# Altium schematic sheet BulbCommander2.SchDoc
size A4
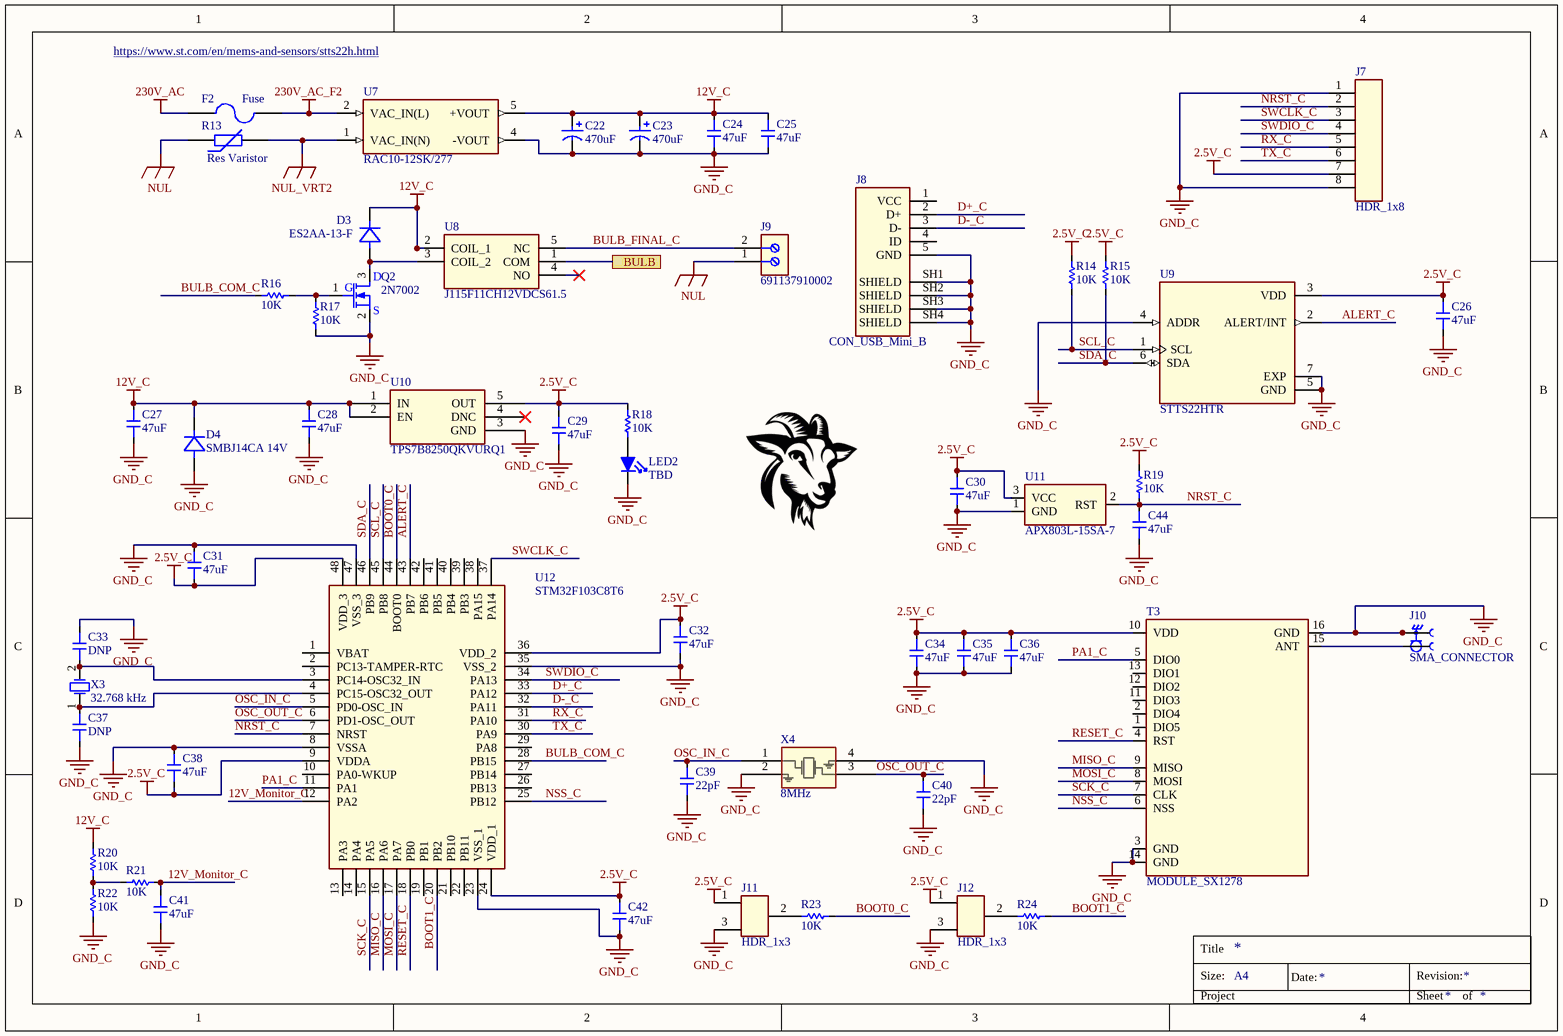
[diagram p0: BulbCommander2.SchDoc]

## Parts
C22  value 470uF  [WCAP-ASLL_D16H17]  (hidden comment: Cap Pol1)
C23  value 470uF  [WCAP-ASLL_D16H17]  (hidden comment: Cap Pol1)
C24  47uF  [2220]
C25  47uF  [2220]
C26  47uF  [CASE0603]
C27  47uF  [1206]
C28  47uF  [1206]
C29  47uF  [1206]
C30  47uF  [CASE0603]
C31  47uF  [CASE0603]
C32  47uF  [CASE0603]
C33  DNP  [CASE0603]
C34  47uF  [CASE0603]
C35  47uF  [CASE0603]
C36  47uF  [CASE0603]
C37  DNP  [CASE0603]
C38  47uF  [CASE0603]
C39  22pF  [CASE0603]
C40  22pF  [CASE0603]
C41  47uF  [CASE0603]
C42  47uF  [CASE0603]
C44  47uF  [CASE0603]
D3  ES2AA-13-F  [SMA_DIODE]
D4  SMBJ14CA 14V  [SMBJSeries_LTF-M]
F2  Fuse  [FUSE]
J7  HDR_1x8  [Header_1x8_2.54_Male]
J8  CON_USB_Mini_B  [CUI_UJ2-MBH-4-SMT]
J9  691137910002  [691137910002]
J10  SMA_CONNECTOR  [LPRS_SMA_CONNECTOR]
J11  HDR_1x3  [Header_1x3_2.54_Male]
J12  HDR_1x3  [Header_1x3_2.54_Male]
LED2  TBD  [CASE0603]
Q2  2N7002  [SOT23-3]
R13  Res Varistor  [AXIAL-0.3]
R14  10K  [CASE0603]
R15  10K  [CASE0603]
R16  10K  [CASE0603]
R17  10K  [CASE0603]
R18  10K  [CASE0603]
R19  10K  [CASE0603]
R20  10K  [CASE0603]
R21  10K  [CASE0603]
R22  10K  [CASE0603]
R23  10K  [CASE0603]
R24  10K  [CASE0603]
T3  MODULE_SX1278  [LORA SX1278]
U7  RAC10-12SK/277  [CONV_RAC10-12SK/277]
U8  J115F11CH12VDCS61.5  [J115F11CH12VDCS615U]
U9  STTS22HTR  [Sensor_6-UDFN]
U10  TPS7B8250QKVURQ1  [SOT_QKVURQ1_TEX]
U11  APX803L-15SA-7  [SOT23-3]
U12  STM32F103C8T6  [QFP50P900X900X160-48N]
X3  32.768 kHz  [XTAL_ECS-.327-12.5-34B-C-TR]
X4  8MHz  [XTAL4P_ABM3B_ABR]

## Ports
BULB

## Nets
2.5V_C: C26.2 C29.2 C30.2 C31.1 C32.2 C34.2 C35.2 C36.2 C38.2 C42.2 J7.7 J11.1 J12.1 R14.2 R15.2 R18.2 R19.2 T3.10(VDD) U9.3(VDD) U10.5(OUT) U11.3(VCC) U12.9(VDDA) U12.24(VDD_1) U12.36(VDD_2) U12.48(VDD_3)
12V_C: C22.1 C23.1 C24.2 C25.2 C27.2 C28.2 D3.1 D4.1 R20.2 U7.5(+VOUT) U8.2(COIL_1) U10.1(IN) U10.2(EN)
230V_AC: F2.1
230V_AC_F2: F2.2 U7.2(VAC_IN(L))
GND_C: C22.2 C23.2 C24.1 C25.1 C26.1 C27.1 C28.1 C29.1 C30.1 C31.2 C32.1 C33.2 C34.1 C35.1 C36.1 C37.2 C38.1 C39.2 C40.2 C41.2 C42.1 C44.1 D4.2 J7.1 J7.8 J8.5(GND) J8.SH1(SHIELD) J8.SH2(SHIELD) J8.SH3(SHIELD) J8.SH4(SHIELD) J10.G1 J10.G2 J10.G3 J10.G4 J11.3 J12.3 LED2.2(K) Q2.2(S) R17.1 R22.1 T3.3(GND) T3.14(GND) T3.16(GND) U7.4(-VOUT) U9.4(ADDR) U9.5(GND) U9.7(EXP) U10.3(GND) U11.1(GND) U12.8(VSSA) U12.23(VSS_1) U12.35(VSS_2) U12.47(VSS_3) X4.2 X4.4
NUL: J9.1 R13.1
NUL_VRT2: R13.2 U7.1(VAC_IN(N))
12V_Monitor_C: C41.1 R21.2 U12.12(PA2)
ALERT_C: U9.2(ALERT/INT) U12.43(PB7)
BOOT0_C: R23.1 U12.44(BOOT0)
BOOT1_C: R24.1 U12.20(PB2)
BULB: U8.1(COM) ; port BULB
BULB_COM_C: R16.2 U12.28(PB15)
BULB_FINAL_C: J9.2 U8.5(NC)
D+_C: J8.2(D+) U12.33(PA12)
D-_C: J8.3(D-) U12.32(PA11)
MISO_C: T3.9(MISO) U12.16(PA6)
MOSI_C: T3.8(MOSI) U12.17(PA7)
NRST_C: C44.2 J7.2 R19.1 U11.2(RST) U12.7(NRST)
NSS_C: T3.6(NSS) U12.25(PB12)
OSC_IN_C: C39.1 U12.5(PD0-OSC_IN) X4.1
OSC_OUT_C: C40.1 U12.6(PD1-OSC_OUT) X4.3
PA1_C: T3.5(DIO0) U12.11(PA1)
RESET_C: T3.4(RST) U12.18(PB0)
RX_C: J7.5 U12.31(PA10)
SCK_C: T3.7(CLK) U12.15(PA5)
SCL_C: R14.1 U9.1(SCL) U12.45(PB8)
SDA_C: R15.1 U9.6(SDA) U12.46(PB9)
SWCLK_C: J7.3 U12.37(PA14)
SWDIO_C: J7.4 U12.34(PA13)
TX_C: J7.6 U12.30(PA9)
NetC33_1: C33.1 U12.3(PC14-OSC32_IN) X3.2(OSC2)
NetC37_1: C37.1 U12.4(PC15-OSC32_OUT) X3.1(OSC1)
NetD3_2: D3.2 Q2.3(D) U8.3(COIL_2)
NetJ10_1: J10.1 T3.15(ANT)
NetJ11_2: J11.2 R23.2
NetJ12_2: J12.2 R24.2
NetLED2_1: LED2.1(A) R18.1
NetQ2_1: Q2.1(G) R16.1 R17.2
NetR20_1: R20.1 R21.1 R22.2

Not connected (* = marked no-connect by the designer): J8 1(VCC) 4(ID); T3 1(DIO5) 2(DIO4) 11(DIO3) 12(DIO2) 13(DIO1); U8 4(NO)*; U10 4(DNC)*; U12 1(VBAT) 2(PC13-TAMPER-RTC) 10(PA0-WKUP) 13(PA3) 14(PA4) 19(PB1) 21(PB10) 22(PB11) 26(PB13) 27(PB14) 29(PA8) 38(PA15) 39(PB3) 40(PB4) 41(PB5) 42(PB6)

## Notes on the sheet
- https://www.st.com/en/mems-and-sensors/stts22h.html
- Title
- Size:
- A4
- Date:
- Revision:
- Project
- Sheet
- of

## Library data of the parts
C22 C23 = Capacitor_Pol_470uF: Published: 8-Jun-2000; LatestRevisionDate: 17-Jul-2002; LatestRevisionNote: Re-released for DXP Platform.; PackageReference: RB7.6-15; Publisher: Altium Limited; PackageDescription: Polarized Capacitor (Radial); 2 Leads
C24 C25 = Capacitor_47uF_2220: CAP CER 47uF 20% 35V X7R 2220; MFR: TBD; MFR PN: TBD; Supplier: TBD; Supplier PN: TBD; Datasheet: TBD
C26-C32 C34-C36 C38-C42 C44 = Capacitor_47uF_1206: CAP CER 47uF 20% 35V X7R 2220; MFR: TBD; MFR PN: TBD; Supplier: TBD; Supplier PN: TBD; Datasheet: TBD
C33 C37 = Capacitor_47uF_0603: CAP CER 47uF 20% 35V X7R 2220; MFR: TBD; MFR PN: TBD; Supplier: TBD; Supplier PN: TBD; Datasheet: TBD
D3 = Diode_SMA: DIODE STANDARD 50V 2A SMA; MFR: Diodes Incoprated; MFR PN: ES2AA-13-F; SUpplier: DigiKey; Supplier PN: ES2AA-FDICT-ND; Datasheet: https://www.digikey.ro/en/products/detail/diodes-incorporated/ES2AA-13-F/765452?curr=usd&utm_campaign=buynow&utm_medium=aggregator&utm_source=octopart
D4 = Diode_SMBJ14CA: SMBJ14CA TVS DIODE 14V; Mfr_Name: Littelfuse Inc
J7 = HDR_1x8: HDR MALE 2.54MM PCB; MFR: Wurth; MFR PN: 691210910002; Datasheet: https://www.digikey.ro/en/products/detail/w%C3%BCrth-elektronik/691210910002/10668428?s=N4IgTCBcDaIGwE4CMYkAZlqxAugXyA; Supplier PN: 732-691210910002-ND; Supplier: Digi Key
J8 = CON_USB_Mini_B: USB B mini; MFR: Same Sky; MFR PN: 102-5892-1-ND; Datasheet: https://www.digikey.ro/en/products/detail/same-sky-formerly-cui-devices/UJ2-MBH-4-SMT-TR/6188086; Supplier: DigiKey; Supplier PN: 102-5892-1-ND
J9 = CON_1x2: TERM BLOCK 2P HORIZON 7.5MM PCB; MFR: Wurth; MFR PN: 691101710002; Datasheet: https://www.digikey.ro/en/products/detail/w%C3%BCrth-elektronik/691101710002/2060522?s=N4IgTCBcDaIGwE4CMSAMSDsbWogXQF8g; Supplier PN: 732-2026-ND; Supplier: Digi Key
J10 = SMA_CONNECTOR: Straight SMA Connector; MP: altium_native_batch; Value: *; Package: None; Availability: Unavailable; Price: None
J11 J12 = HDR_1x3: HDR MALE 3 x 2.54MM PCB; MFR: Wurth; MFR PN: 691210910002; Datasheet: https://www.digikey.ro/en/products/detail/w%C3%BCrth-elektronik/691210910002/10668428?s=N4IgTCBcDaIGwE4CMYkAZlqxAugXyA; Supplier PN: 732-691210910002-ND; Supplier: Digi Key
LED2 = LED: Typical INFRARED GaAs LED
Q2 = Transistor_NMOS: MOSFET N-CH 60V 280MA SOT23-3; MFR: Microchip; MFR PN: 2N7002-G; Supplier: 689-2N7002-G; Supplier PN: 689-2N7002-G; Datasheetr: https://eu.mouser.com/ProductDetail/Microchip-Technology/2N7002-G?qs=D%2FHwGy7fPj%2F0m3YgJ%252BOEvg%3D%3D&gad_source=1&gclid=CjwKCAiA-vOsBhAAEiwAIWR0TUe7q_QostOicZHu1AHXgQXTk64doIjIByY-NhPhM9vjgvrvT5qG4BoC-HkQAvD_BwE&_gl=1*1hvi63b*_ga*MjAyNjQwOTA4MS4xNzA0NjI4Mjkx*_ga_15W4STQT4T*MTcwNDgyMjg3Ni4yLjEuMTcwNDgyMjg3Ni42MC4wLjA.
R13 = Res Varistor: Varistor (Voltage-Sensitive Resistor); Published: 24-Mar-1999; LatestRevisionDate: 29-May-2009; LatestRevisionNote: IPC-7351 Footprint Added.; PackageVersion: Mar-2003; PackageReference: 6-0805; Publisher: Altium Limited; PackageDescription: Chip Resistor 0805 Case Size; Code_IPC: RESC2012
R14-R24 = Resistor_10K_0603: RES 10K 1% 1/10W 0603; MFR: YAGEO; MFR PN: RC0603FR-0710KL; Supplier: Mouser; Supplier PN: 603-RC0603FR-0710KL; Datasheet: https://eu.mouser.com/ProductDetail/YAGEO/RC0603FR-0710KL?qs=grNVn54RoB%252B3GtjbJj3wJQ%3D%3D
T3 = MODULE_SX1278: MODULE_SX1278 LORA 433 MHz; Datasheet: https://www.aliexpress.com/item/1005001894642323.html; MFR: LORA; MFR PN: LORA; Supplier: LORA; Supplier PN: LORA
U7 = CONV_RAC10-12SK/277: AC/DC CONVERTER 12V 10W; MFR: RECOM; Datasheet: https://recom-power.com/pdf/Powerline_AC-DC/RAC10-K_277.pdf; MFR PN: RAC10-12SK/277; Supplier: Digi Key; Supplier PN: 945-3122-5-ND
U8 = RELAY_J115F11CH12VDCS61.5: RELAY GEN PURPOSE SPDT 50A 12V; MFR: CIT Relay and Switch; Datasheet: https://www.citrelay.com/Catalog%20Pages/RelayCatalog/J115F%2050amp.pdf; MFR PN: J115F11CH12VDCS61.5; Supplier: Digi Key; Supplier PN: J115F11CH12VDCS61.2449-J115F11CH12VDCS61.5-ND5U
U9 = SENSOR_STTS22HTR: Low-voltage, ultralow-power, 0.5°C accuracy I²C/SMBus 3.0 temperature sensor; MFR: STMicroelectronics; MFR PN: STTS22HTR; Supplier PN: 497-STTS22HCT-ND; Supplier: Digi-Key; Datasheet: https://www.digikey.com/en/products/detail/stmicroelectronics/STTS22HTR/10668399
U10 = CONV_LDO_TPS7B8250QKVURQ1: MFR: Texas Instruments; MFR PN: TPS7B8250QKVURQ1; Supplier PN: 296-TPS7B8250QKVURQ1CT-ND; Supplier: DigiKey; Datasheet: https://www.digikey.ro/en/products/detail/texas-instruments/TPS7B8250QKVURQ1/12352207?s=N4IgTCBcDaICoAUDKB2AQgDjAVgAwEUBpANQFUAlfARhAF0BfIA
U11 = IC_APX803L-15SA-7: Supervisor Open Drain or Open Collector 1 Channel SOT-23-3; MFR: Diodes Incorporated; Datasheet: https://www.aliexpress.com/item/1005001894642323.html; MFR PN: APX803L-15SA-7; Supplier: Digi key; Supplier PN: 31-APX803L-15SA-7CT-ND
U12 = IC_STM32F103C8T6: IC MCU 32BIT 64KB FLASH 48LQFP; MFR: STMicroelectronics; Datasheet: https://www.st.com/resource/en/datasheet/stm32f103cb.pdf; MFR PN: STM32F103C8T6; Supplier: Digi Key; Supplier PN: 497-6063-ND
X3 = Crystal_ECS-.327-12.5-34B-C-TR: 32.768 kHz ±10ppm Crystal 12.5pF 70 kOhms 2-SMD, No Lead; MFR: ECS; MFR PN: ECS-.327-12.5-34B-C-TR; Datasheet: https://www.digikey.ro/en/products/detail/ecs-inc/ECS-327-12-5-34B-C-TR/3927328; Supplier PN: XC1968CT-ND; Supplier: Digi Key
X4 = ABM3B-8.000MHZ-10-1UT: 8 MHz Crystal; MFR: Abracon; MFR PN: ABM3B-8.000MHZ-10-1-U-T; Datasheet: https://www.digikey.ro/en/products/detail/abracon-llc/ABM3B-8-000MHZ-10-1-U-T/1873167; Supplier: Digi-Key; Supplier PN: 535-9721-1-ND
F2 = Fuse: Published: 8-Jun-2000; LatestRevisionDate: 17-Jul-2002; LatestRevisionNote: Re-released for DXP Platform.; PackageReference: PIN-W2/E2.8; Publisher: Altium Limited; PackageDescription: Thru-Hole; 2 Leads